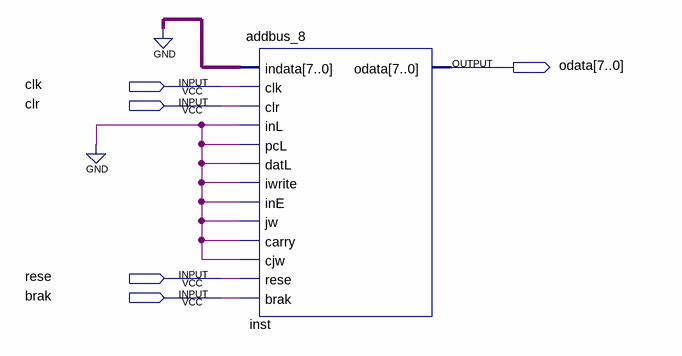
[diagram p0: schematic sheet]
// Quartus schematic mycpu.bdf as structural Verilog: 1 symbols, 5 pins
module mycpu (
  input  clk,
  input  clr,
  input  rese,
  input  brak,
  output [7:0] odata
);

  addbus_8 inst (
    .indata({8{1'b0}}), .clk(clk), .clr(clr), .inL(1'b0), .pcL(1'b0), .datL(1'b0), .iwrite(1'b0), .inE(1'b0),
    .jw(1'b0), .carry(1'b0), .cjw(1'b0), .rese(rese), .brak(brak), .odata(odata));
endmodule
